# EAGLE design Raspberry_pi_shild_v1 (EAGLE 6.5.0)
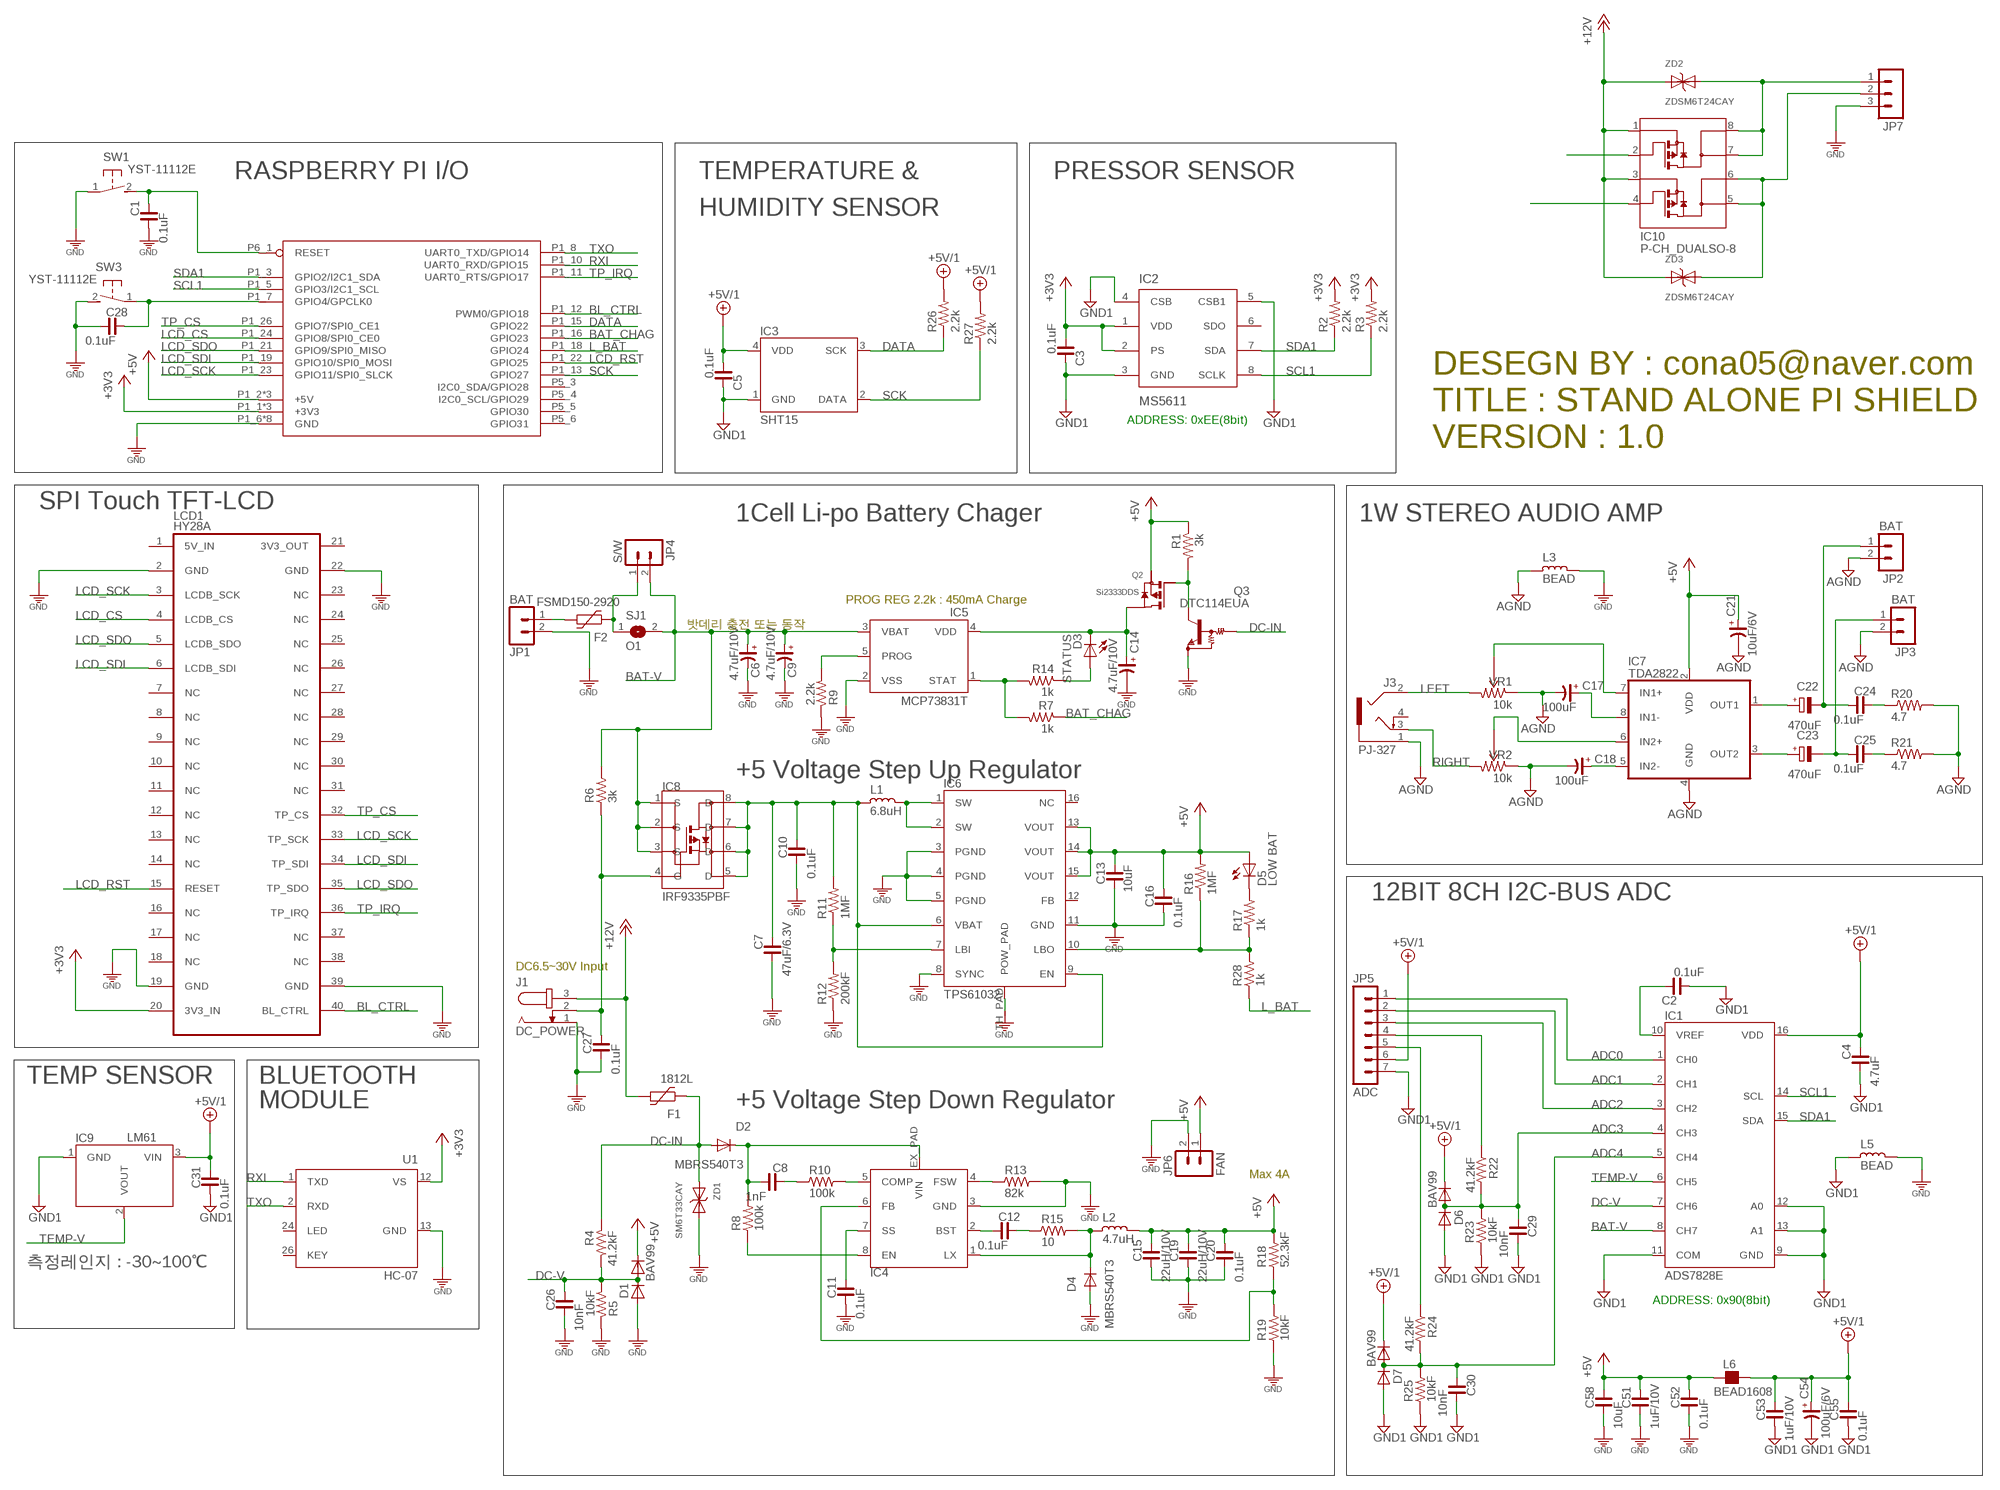
[diagram p0: schematic, sheet 1]

## Parts
C1  0.1uF  C_0603  [C0603]
C2  0.1uF  C_0603  [C0603]
C3  0.1uF  C_0603  [C0603]
C4  4.7uF  C_0805  [C0805]
C5  0.1uF  C_0603  [C0603]
C6  4.7uF/10V  CP_3216-18  [C3216-18/T]
C7  47uF/6.3V  C_3216  [C3216]
C8  1nF  C_0603  [C0603]
C9  4.7uF/10V  CP_3216-18  [C3216-18/T]
C10  0.1uF  C_0603  [C0603]
C11  0.1uF  C_0603  [C0603]
C12  0.1uF  C_0603  [C0603]
C13  10uF  C_2012  [C2012]
C14  4.7uF/10V  CP_3216-18  [C3216-18/T]
C15  22uH/10V  C_3216  [C3216]
C16  0.1uF  C_0603  [C0603]
C17  100uF  CP_3528-21  [C3528-21/T]
C18  100uF  CP_3528-21  [C3528-21/T]
C19  22uH/10V  C_3216  [C3216]
C20  0.1uF  C_0603  [C0603]
C21  10uF/6V  CP_3216-18  [C3216-18/T]
C22  470uF  CPOL-EUD/7343-31W  [D/7343-31W]
C23  470uF  CPOL-EUD/7343-31W  [D/7343-31W]
C24  0.1uF  C_0603  [C0603]
C25  0.1uF  C_0603  [C0603]
C26  10nF  C_0603  [C0603]
C27  0.1uF  C_0603  [C0603]
C28  0.1uF  C_0603  [C0603]
C29  10nF  C_0603  [C0603]
C30  10nF  C_0603  [C0603]
C31  0.1uF  C_0603  [C0603]
C51  1uF/10V  C_0603  [C0603]
C52  0.1uF  C_0603  [C0603]
C53  1uF/10V  C_0603  [C0603]
C54  100uF/6V  CP_3528-21  [C3528-21/T]
C55  0.1uF  C_0603  [C0603]
C58  10uF  C_0805  [C0805]
D1  BAV99  [SOT23]
D2  MBRS540T3  DIODE-SMC  [SMC]
D3  STATUS  LED3MM  [LED3MM]
D4  MBRS540T3  DIODE-SMC  [SMC]
D5  LOW BAT  LED3MM  [LED3MM]
D6  BAV99  [SOT23]
D7  BAV99  [SOT23]
F1  1812L  [1812L]
F2  FSMD150-2920  1812L  [1812L]
IC1  ADS7828E  ADS7828  [R-PDSO-G16]
IC2  MS5611  [LCP8]
IC3  SHT15  [SHT1X]
IC4  AOZ1284PI  [S08-EP1]
IC5  MCP73831T  [SOT23-5L@1]
IC6  TPS61032  [R-PDSO-G16-TH_PAD]
IC7  TDA2822  [SO08]
IC8  IRF9335PBF  HEXFET_P  [SO08]
IC9  LM61  [TO92-]
IC10  P-CH_DUALSO-8  [SO08-1]
J1  DC_POWER  JACK-PLUG0  [SPC4077]
J3  PJ-327  AUDIO_JACK2  [PJ-327-2]
JP1  BAT  MA02MOL-R  [MA02-MOL-R]
JP2  BAT  MA02MOL-R  [MA02-MOL-R]
JP3  BAT  MA02MOL-R  [MA02-MOL-R]
JP4  S/W  MA02MOL-R  [MA02-MOL-R]
JP5  ADC  MA07-1  [MA07-1T]
JP6  FAN  MA02MOL-R  [MA02-MOL-R]
JP7  MA03-1SMALL  [MA03-1-S]
L1  6.8uH  L_4545  [L4545]
L2  4.7uH  L_4545  [L4545]
L3  BEAD  L_0603  [L0603]
L5  BEAD  L_0603  [L0603]
L6  BEAD1608  FB_0603  [L0603]
LCD1  HY28A  [HY28A]
Q2  Si2333DDS  P-FET  [SOT23]
Q3  DTC114EUA  [SC59-BEC]
R1  3k  R_0603  [R0603]
R2  2.2k  R-US_R1608  [R0603]
R3  2.2k  R-US_R1608  [R0603]
R4  41.2kF  R_0603  [R0603]
R5  10kF  R_0603  [R0603]
R6  3k  R_0603  [R0603]
R7  1k  R_0603  [R0603]
R8  100k  R_0603  [R0603]
R9  2.2k  R_0603  [R0603]
R10  100k  R_0603  [R0603]
R11  1MF  R-US_R1608  [R0603]
R12  200kF  R-US_R1608  [R0603]
R13  82k  R_0603  [R0603]
R14  1k  R_0603  [R0603]
R15  10  R_0603  [R0603]
R16  1MF  R-US_R1608  [R0603]
R17  1k  R-US_R1608  [R0603]
R18  52.3kF  R_0603  [R0603]
R19  10kF  R_0603  [R0603]
R20  4.7  R-US_R1608  [R0603]
R21  4.7  R-US_R1608  [R0603]
R22  41.2kF  R_0603  [R0603]
R23  10kF  R_0603  [R0603]
R24  41.2kF  R_0603  [R0603]
R25  10kF  R_0603  [R0603]
R26  2.2k  R-US_R1608  [R0603]
R27  2.2k  R-US_R1608  [R0603]
R28  1k  R_0603  [R0603]
SJ1  O1  SJ  [SJ]
SW1  YST-11112E  [YST-1112E]
SW3  YST-11112E  [YST-1112E]
U1  HC-07  HC-06_MODULEFULL  [HC-06]
U$1  RPI-B-V2NO_SHIELD  [RPI-B-V2]
VR1  10k  R-TRIMMER-SMD3313  [R-TRIMMER-3313J]
VR2  10k  R-TRIMMER-SMD3313  [R-TRIMMER-3313J]
ZD1  SM6T33CAY  ZDSM6T33CAY  [SMB]
ZD2  ZDSM6T24CAY  ZDSM6T33CAY  [SMB]
ZD3  ZDSM6T24CAY  ZDSM6T33CAY  [SMB]

## Nets
+3V3: C3.2 IC2.1(VDD) IC2.2(PS) LCD1.20(3V3_IN) R2.2 R3.2 U1.12(VS) U$1.P1_1(+3V3) U$1.P1_17(+3V3) U$1.P5_2(+3V3)
+5V: C13.1 C15.1 C16.1 C19.1 C20.1 C21.+ C51.1 C52.1 C58.1 D1.S(C) D5.A IC6.13(VOUT) IC6.14(VOUT) IC6.15(VOUT) IC7.2(VDD) JP6.1 L2.1 L6.1 Q2.S(SOURCE) R1.1 R16.2 R18.2 U$1.P1_2(+5V) U$1.P1_4(+5V) U$1.P5_1(+5V)
+5V/1: C4.1 C5.2 C31.1 C53.1 C54.+ C55.1 D6.S(C) D7.S(C) IC1.16(VDD) IC3.4(VDD) IC9.3(VIN) JP5.6 L6.2 R26.2 R27.2
+12V: F1.P$2 IC10.1 IC10.3 J1.3 ZD2.A ZD3.A
ADC0: IC1.1(CH0) JP5.1
ADC1: IC1.2(CH1) JP5.2
ADC2: IC1.3(CH2) JP5.3
ADC3: C29.1 D6.D(AC) IC1.4(CH3) R22.2 R23.2
ADC4: C30.1 D7.D(AC) IC1.5(CH4) R24.2 R25.2
AGND: C17.- C18.- C21.- IC7.4(GND) J3.1 JP2.2 JP3.2 L3.2 R20.2 R21.2 VR1.1 VR2.1
BAT-V: C6.+ C9.+ IC1.8(CH7) IC5.3(VBAT) IC8.1(S) IC8.2(S) IC8.3(S) JP4.2 R6.2 SJ1.2
BAT_CHAG: R7.1 U$1.P1_16(GPIO23)
BL_CTRL: LCD1.40(BL_CTRL) U$1.P1_12(PWM0/GPIO18)
DATA: IC3.3(SCK) R26.1 U$1.P1_15(GPIO22)
DC-IN: D2.A F1.P$1 Q3.2(IN) R4.1 ZD1.A
DC-V: C26.1 D1.D(AC) IC1.7(CH6) R4.2 R5.2
GND [GND]: C1.2 C6.- C7.2 C9.- C10.2 C11.2 C13.2 C14.- C15.2 C16.2 C19.2 C20.2 C26.2 C27.2 C28.2 C51.2 C52.2 C58.2 D1.G(A) D4.A IC4.3(GND) IC5.2(VSS) IC6.3(PGND) IC6.4(PGND) IC6.5(PGND) IC6.8(SYNC) IC6.11(GND) IC6.TH_PAD(POW_PAD) J1.1 JP1.2 JP6.2 JP7.3 L3.1 L5.1 LCD1.2(GND) LCD1.19(GND) LCD1.22(GND) LCD1.39(GND) Q3.1(GND) R5.1 R9.1 R12.1 R13.2 R19.1 SW1.1 SW3.2 U1.13(GND) U$1.P1_6(GND) U$1.P1_9(GND) U$1.P1_14(GND) U$1.P1_20(GND) U$1.P1_25(GND) U$1.P5_7(GND) U$1.P5_8(GND) U$1.P6_2(GND) ZD1.C(K)
GND1: C2.2 C3.1 C4.2 C5.1 C29.2 C30.2 C31.2 C53.2 C54.- C55.2 D6.G(A) D7.G(A) IC1.9(GND) IC1.11(COM) IC1.12(A0) IC1.13(A1) IC2.3(GND) IC2.4(CSB) IC2.5(CSB1) IC3.1(GND) IC9.1(GND) JP5.7 L5.2 R23.1 R25.1
L_BAT: R28.1 U$1.P1_18(GPIO24)
LCD_CS: LCD1.4(LCDB_CS) U$1.P1_24(GPIO8/SPI0_CE0)
LCD_RST: LCD1.15(RESET) U$1.P1_22(GPIO25)
LCD_SCK: LCD1.3(LCDB_SCK) LCD1.33(TP_SCK) U$1.P1_23(GPIO11/SPI0_SLCK)
LCD_SDI: LCD1.6(LCDB_SDI) LCD1.34(TP_SDI) U$1.P1_19(GPIO10/SPI0_MOSI)
LCD_SDO: LCD1.5(LCDB_SDO) LCD1.35(TP_SDO) U$1.P1_21(GPIO9/SPI0_MISO)
LEFT: J3.2 VR1.3
N$1: C28.1 SW3.1 U$1.P1_7(GPIO4/GPCLK0)
N$2: C8.2 D2.C IC4.EX_PAD(VIN) R8.2
N$3: IC4.6(FB) R18.1 R19.2
N$4: C12.2 IC4.2(BST)
N$5: F2.P$1 JP4.1 SJ1.1
N$6: C27.1 IC8.4(G) J1.2 R6.1
N$7: D3.A R14.1
N$8: C12.1 R15.1
N$9: D4.C IC4.1(LX) L2.2 R15.2
N$10: IC4.5(COMP) R10.2
N$11: C8.1 R10.1
N$12: JP5.5 R24.1
N$13: C1.1 SW1.2 U$1.P6_1(RESET)
N$14: JP5.4 R22.1
N$15: D5.K(C) R17.2
N$16: F2.P$2 JP1.1
N$17: IC6.7(LBI) R11.1 R12.2
N$19: IC4.8(EN) R8.1
N$20: IC10.2
N$21: IC4.4(FSW) R13.1
N$22: C2.1 IC1.10(VREF)
N$23: Q2.G(GATE) Q3.3(OUT) R1.2
N$24: C11.1 IC4.7(SS)
N$26: C14.+ D3.K(C) IC5.4(VDD) Q2.D(DRAIN)
N$27: IC5.1(STAT) R7.2 R14.2
N$28: C7.1 C10.1 IC6.6(VBAT) IC6.9(EN) IC8.5(D) IC8.6(D) IC8.7(D) IC8.8(D) L1.2 R11.2
N$29: IC6.10(LBO) R16.1 R17.1 R28.2
N$30: IC6.1(SW) IC6.2(SW) L1.1
N$31: IC10.4
N$35: IC5.5(PROG) R9.2
N$36: C17.+ IC7.8(IN1-)
N$37: C18.+ IC7.5(IN2-)
N$39: IC7.6(IN2+) VR2.2
N$41: IC7.7(IN1+) VR1.2
N$42: C22.+ IC7.1(OUT1)
N$43: C23.+ IC7.3(OUT2)
N$44: C22.- C24.2 JP2.1
N$45: C23.- C25.2 JP3.1
N$46: C24.1 R20.1
N$47: C25.1 R21.1
RELAY1: IC10.5 IC10.6 JP7.2 ZD3.C(K)
RELAY2: IC10.7 IC10.8 JP7.1 ZD2.C(K)
RIGHT: J3.3 VR2.3
RXI: U1.1(TXD) U$1.P1_10(UART0_RXD/GPIO15)
SCK: IC3.2(DATA) R27.1 U$1.P1_13(GPIO27)
SCL1: IC1.14(SCL) IC2.8(SCLK) R3.1 U$1.P1_5(GPIO3/I2C1_SCL)
SDA1: IC1.15(SDA) IC2.7(SDA) R2.1 U$1.P1_3(GPIO2/I2C1_SDA)
TEMP-V: IC1.6(CH5) IC9.2(VOUT)
TP_CS: LCD1.32(TP_CS) U$1.P1_26(GPIO7/SPI0_CE1)
TP_IRQ: LCD1.36(TP_IRQ) U$1.P1_11(UART0_RTS/GPIO17)
TXO: U1.2(RXD) U$1.P1_8(UART0_TXD/GPIO14)
Unconnected: IC2.6(SDO) IC6.12(FB) IC6.16(NC) J3.4 LCD1.1(5V_IN) LCD1.7(NC) LCD1.8(NC) LCD1.9(NC) LCD1.10(NC) LCD1.11(NC) LCD1.12(NC) LCD1.13(NC) LCD1.14(NC) LCD1.16(NC) LCD1.17(NC) LCD1.18(NC) LCD1.21(3V3_OUT) LCD1.23(NC) LCD1.24(NC) LCD1.25(NC) LCD1.26(NC) LCD1.27(NC) LCD1.28(NC) LCD1.29(NC) LCD1.30(NC) LCD1.31(NC) LCD1.37(NC) LCD1.38(NC) U1.24(LED) U1.26(KEY)

## Notes on the sheet
- RASPBERRY PI I/O | TEMPERATURE & | PRESSOR SENSOR
- HUMIDITY SENSOR
- DESEGN BY : cona05@naver.com
- TITLE : STAND ALONE PI SHIELD
- ADDRESS: 0xEE(8bit)
- VERSION : 1.0
- SPI Touch TFT-LCD
- 1Cell Li-po Battery Chager | 1W STEREO AUDIO AMP
- PROG REG 2.2k : 450mA Charge
- 밧데리 충전 또는 동작
- +5 Voltage Step Up Regulator
- 12BIT 8CH I2C-BUS ADC
- DC6.5~30V Input
- TEMP SENSOR | BLUETOOTH
- MODULE | +5 Voltage Step Down Regulator
- Max 4A
- 측정레인지 : -30~100℃
- ADDRESS: 0x90(8bit)

## Power pins joined to a net without a drawn wire
GPIO30: U$1.P5_5(GPIO30)
GPIO31: U$1.P5_6(GPIO31)
I2C0_SCL/GPIO29: U$1.P5_4(I2C0_SCL/GPIO29)
I2C0_SDA/GPIO28: U$1.P5_3(I2C0_SDA/GPIO28)

## Library data of the parts
C1-C5 C7 C8 C10-C13 C15 C16 C19 C20 C24-C31 C51-C53 C55 C58 = cona_lib:C_: NON-POLARIZED CAP
C6 C9 C14 C17 C18 C21 C54 = rc-master-smd:CP_: POLARIZED CAP
C22 C23 = cona_lib:CPOL-EU: POLARIZED CAPACITOR, European symbol
D1 D6 D7 = cona_lib:BAV99
D2 D4 = diode:DIODE-: DIODE
D3 D5 = cona_lib:LED: LED OSRAM: - CHIPLED LG R971, LG N971, LY N971, LG Q971, LY Q971, LO R971, LY R971 LH N974, LH R974 LS Q976, LO Q976, LY Q976 LO Q996 - Hyper CHIPLED LW Q18S LB Q993, LB Q99A, LB R99A - SideLED LS A670, LO A670, LY A670, LG A670, LP A670 LB A673, LV A673, LT A673, LW A673 LH A674 LY A675 LS A676, LA A676, LO A676, LY A676, LW A676 LS A679, LY A679, LG A679 - Hyper Micro SIDELED® LS Y876, LA Y876, LO Y876, LY Y876 LT Y87S - SmartLED LW L88C, LW L88S LB L89C, LB L89S, LG L890 LS L89K, LO L89K, LY L89K LS L896, LA L896, LO L896, LY L896 - TOPLED LS T670, LO T670, LY T670, LG T670, LP T670 LSG T670, LSP T670, LSY T670, LOP T670, LYG T670 LG T671, LOG T671, LSG T671 LB T673, LV T673, LT T673, LW T673 LH T674 LS T676, LA T676, LO T676, LY T676, LB T676, LH T676, LSB T676, LW T676 LB T67C, LV T67C, LT T67C, LS T67K, LO T67K, LY T67K, LW E67C LS E67B, LA E67B, LO E67B, LY E67B, LB E67C, LV E67C, LT E67C LW T67C LS T679, LY T679, LG T679 LS T770, LO T770, LY T770, LG T770, LP T770 LB T773, LV T773, LT T773, LW T773 LH T774 LS E675, LA E675, LY E675, LS T675 LS T776, LA T776, LO T776, LY T776, LB T776 LHGB T686 LT T68C, LB T68C - Hyper Mini TOPLED® LB M676 - Mini TOPLED Santana® LG M470 LS M47K, LO M47K, LY M47K Source: http://www.osram.convergy.de LUXEON: - LUMILED® LXK2-PW12-R00, LXK2-PW12-S00, LXK2-PW14-U00, LXK2-PW14-V00 LXK2-PM12-R00, LXK2-PM12-S00, LXK2-PM14-U00 LXK2-PE12-Q00, LXK2-PE12-R00, LXK2-PE12-S00, LXK2-PE14-T00, LXK2-PE14-U00 LXK2-PB12-K00, LXK2-PB12-L00, LXK2-PB12-M00, LXK2-PB14-N00, LXK2-PB14-P00, LXK2-PB14-Q00 LXK2-PR12-L00, LXK2-PR12-M00, LXK2-PR14-Q00, LXK2-PR14-R00 LXK2-PD12-Q00, LXK2-PD12-R00, LXK2-PD12-S00 LXK2-PH12-R00, LXK2-PH12-S00 LXK2-PL12-P00, LXK2-PL12-Q00, LXK2-PL12-R00 Source: www.luxeon.com KINGBRIGHT: KA-3528ASYC Source: www.kingbright.com
F1 F2 = ptc-littlefuse:1812L
IC1 = cona_lib:ADS7828
IC2 = MEASUREMENT_SENSOR:MS5611
IC3 = cona_lib:SHT15
IC4 = cona_lib:AOZ1284PI
IC5 = cona_lib:MCP73831T
IC6 = cona_lib:TPS61032
IC7 = cona_lib:TDA2822
IC8 = cona_lib:HEXFET_P
IC9 = cona_lib:LM61
IC10 = cona_lib:P-CH_DUAL
J1 = con-jack:JACK-PLUG: DC POWER JACK Power Jack, DC, Right Angle, Through Hole, Rated 5A at 16VDC, PC Terminals Distributor: Farnell (www.Farnell.de) Drawing: 84N1161.pdf / 84N1162.pdf Manufacturer: SPC Technology (www.spctechnology.com) Type: SPC4077 / SPC 4078
J3 = cona_lib:AUDIO_JACK2
JP1-JP4 JP6 = cona_lib:MA02
JP5 = cona_lib:MA07-1
JP7 = cona_lib:MA03-1: PIN HEADER
L1-L3 L5 = cona_lib:L_: INDUCTOR
L6 = rc-master-smd:FB_: FERRITE BEAD
LCD1 = TFT-LCD:HY28A
Q2 = cona_lib:P-FET
Q3 = cona_lib:DTC114EUA: NPN Bias Resistor Transistor
R1 R4-R10 R13-R15 R18 R19 R22-R25 R28 = cona_lib:R_: RESISTOR
R2 R3 R11 R12 R16 R17 R20 R21 R26 R27 = cona_lib:R-US_: RESISTOR, American symbol
SJ1 = cona_lib:SJ: SMD solder JUMPER
SW1 SW3 = switch-tact:YST-11112E
U1 = cona_lib:HC-06_MODULE
U$1 = raspberrypi:RPI-B-V2: Second revision of the Model 2 board including the P5 and P6 headers. Mounting holes have been added. Choose the "SHIELD" variant for a predefined Dimension layer and drilling holes. Theres also a "SHIELD" variant for the Model A without a RJ45 connector.
VR1 VR2 = cona_lib:R-TRIMMER-SMD: SMD R-TRIMMER
ZD1-ZD3 = GRU-EURO6:ZD

## Net classes
0 default: width 0.178 mm, drill 0.3 mm, clearance 0.178 mm
1 power: width 0.152 mm
2 GND: width 0.152 mm, clearance 0.152 mm

## Board
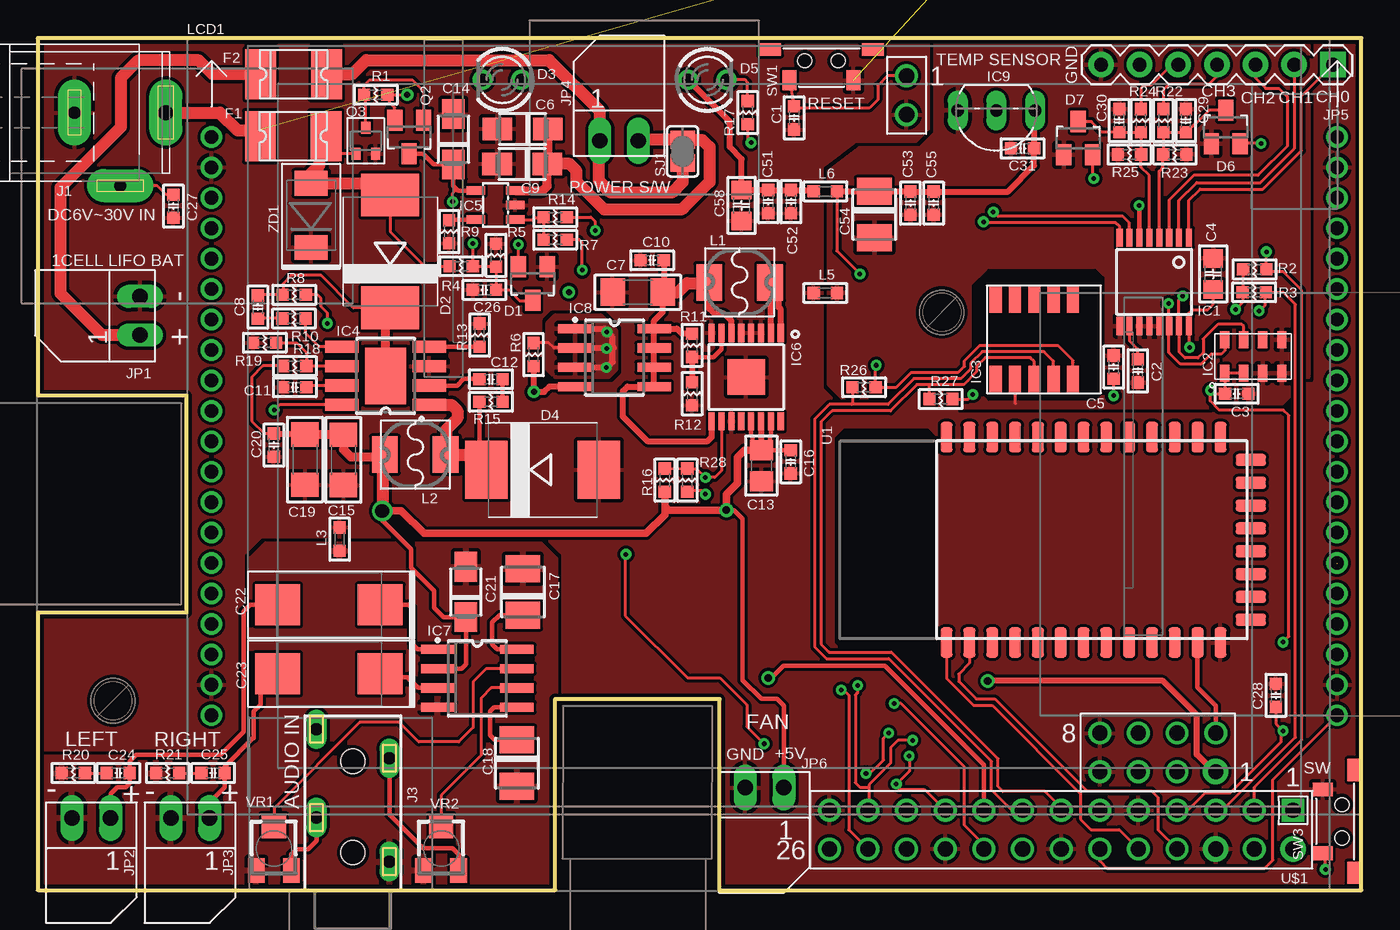
[diagram p1: board, top side]
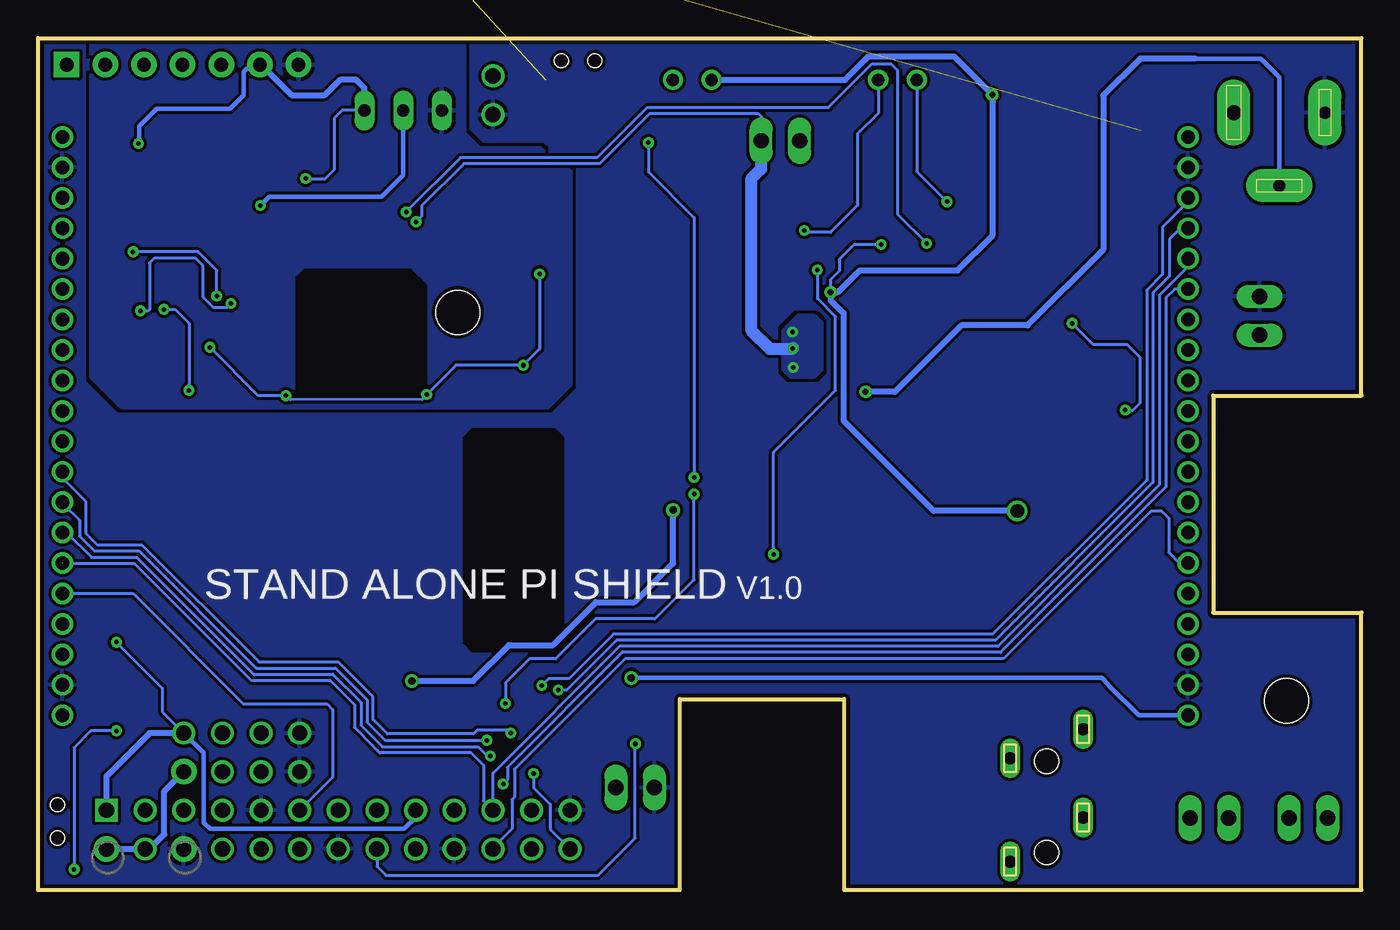
[diagram p2: board, bottom side, seen from below]

Size 87 x 56 mm. Coordinates in mm from the lower left corner, seen from the top.
Outline: 87,56 0,56 0,32.5 9.75,32.5 9.75,18.25 0,18.25 0,0 34,0 34,12.55 44.8,12.55 44.8,0 87,0 87,56
Copper layers (1*16): Top 0.035mm / dielectric 1.5mm / Bottom 0.035mm
Design rules "KHC_mm": minimum track width 0.2mm, minimum drill 0.3mm, track to track 0.2mm, track to pad 0.2mm, pad to pad 0.2mm, via to via 0.2mm, smd to smd 0.2mm, copper to edge 10mil, drill to drill 0.2mm, minimum pad ring 10mil, minimum via ring 8mil, stop-mask expansion 4mil, vias tented up to drill 0mil, thermal gap 10mil
Holes 2.9 mm at 59.4,37.98 4.92,12.45

### Footprints (pad centres in the part's own frame; a part is rotated, then mirrored left to right if it is on the bottom)
C0603 = smd 0.8 x 0.8: 1 -0.762,0; 2 0.762,0
C0805 = smd 1.2 x 1.3: 1 -1.016,0; 2 1.016,0
C3216-18/T = smd 1.95 x 1.5: + 1.651,0; - -1.651,0
C3216 = smd 1.6 x 1.8: 1 -1.651,0; 2 1.651,0
C2012 = smd 1.3 x 1.5: 1 -1.016,0; 2 1.016,0
C3528-21/T = smd 1.778 x 2.286: + 1.524,0; - -1.524,0
D/7343-31W = smd 2.95 x 2.7: + 3.375,0; - -3.375,0
SOT23 = smd 1 x 1.4: D 0,-1.1; G 0.95,1.1; S -0.95,1.1
SMC = smd 2.8 x 3.8: A 3.7,0; C -3.7,0
LED3MM = drill 0.813: A -1.27,0; K 1.27,0
1812L = smd 2.03 x 3.3: P$1 -2.16,0; P$2 2.16,0
R-PDSO-G16 = smd 0.4 x 1.2: 1 -2.275,-2.9; 2 -1.625,-2.9; 3 -0.975,-2.9; 4 -0.325,-2.9; 5 0.325,-2.9; 6 0.975,-2.9; 7 1.625,-2.9; 8 2.275,-2.9; 9 2.275,2.9; 10 1.625,2.9; 11 0.975,2.9; 12 0.325,2.9; 13 -0.325,2.9; 14 -0.975,2.9; 15 -1.625,2.9; 16 -2.275,2.9
LCP8 = smd 1.1 x 0.6: 1 -1.1,1.875; 2 -1.1,0.625; 3 -1.1,-0.625; 4 -1.1,-1.875; 5 1.1,-1.875; 6 1.1,-0.625; 7 1.1,0.625; 8 1.1,1.875
SHT1X = smd 1.8 x 0.8: 1 -2.64,1.905; 2 -2.64,0.635; 3 -2.64,-0.635; 4 -2.64,-1.905; NC 2.64,-1.905; NC@1 2.64,-0.635; NC@2 2.64,0.635; NC@3 2.64,1.905; NC@4 2.64,3.175; NC@5 -2.64,3.175
S08-EP1 = smd 0.8 x 2.2: 1 -1.905,-2.87; 2 -0.635,-2.87; 3 0.635,-2.87; 4 1.905,-2.87; 5 1.905,2.87; 6 0.635,2.87; 7 -0.635,2.87; 8 -1.905,2.87 | smd 3.7 x 2.71: EX_PAD 0,0
SOT23-5L@1 = smd 0.55 x 1.2: 1 -0.95,-1.3; 2 0,-1.3; 3 0.95,-1.3; 4 0.95,1.3; 5 -0.95,1.3
R-PDSO-G16-TH_PAD = smd 0.4 x 1.2: 1 -2.275,-2.9; 2 -1.625,-2.9; 3 -0.975,-2.9; 4 -0.325,-2.9; 5 0.325,-2.9; 6 0.975,-2.9; 7 1.625,-2.9; 8 2.275,-2.9; 9 2.275,2.9; 10 1.625,2.9; 11 0.975,2.9; 12 0.325,2.9; 13 -0.325,2.9; 14 -0.975,2.9; 15 -1.625,2.9; 16 -2.275,2.9 | smd 2.46 x 2.31: TH_PAD 0,0
SO08 = smd 0.6 x 2.2: 1 -1.905,-2.6; 2 -0.635,-2.6; 3 0.635,-2.6; 4 1.905,-2.6; 5 1.905,2.6; 6 0.635,2.6; 7 -0.635,2.6; 8 -1.905,2.6
TO92- = drill 0.813 long: 1 2.54,0; 2 0,0; 3 -2.54,0
SO08-1 = smd 0.6 x 2.2: 1 -1.905,-2.6; 2 -0.635,-2.6; 3 0.635,-2.6; 4 1.905,-2.6; 5 1.905,2.6; 6 0.635,2.6; 7 -0.635,2.6; 8 -1.905,2.6
SPC4077 = drill 0.8 pad 2.184 long: 1 -3,0; 2 0,-4.8 | drill 1 pad 2.184 long: 3 3,0
PJ-327-2 = drill 0.8 long: 1 -2.4,-1.9; 2 2.4,-4.8; 3 -2.4,-8.7; 4 2.4,-10.6 | hole 1.6: 0,-2.5; 0,-8.5
MA02-MOL-R = drill 1.016 long: 1 -1.27,0; 2 1.27,0
MA07-1T = drill 0.9 pad 1.676 square: 1 -7.62,0 | drill 0.9 pad 1.676: 2 -5.08,0; 3 -2.54,0; 4 0,0; 5 2.54,0; 6 5.08,0; 7 7.62,0
MA03-1-S = drill 0.9 pad 1.676 square: 1 -2.54,0 | drill 0.9 pad 1.676: 2 0,0; 3 2.54,0
L4545 = smd 1.7 x 2.4: 1 -2,0; 2 2,0
L0603 = smd 0.8 x 0.8: 1 -0.762,0; 2 0.762,0
HY28A = drill 0.9: 1 -37,19; 2 -37,17; 3 -37,15; 4 -37,13; 5 -37,11; 6 -37,9; 7 -37,7; 8 -37,5; 9 -37,3; 10 -37,1; 11 -37,-1; 12 -37,-3; 13 -37,-5; 14 -37,-7; 15 -37,-9; 16 -37,-11; 17 -37,-13; 18 -37,-15; 19 -37,-17; 20 -37,-19; 21 37,19; 22 37,17; 23 37,15; 24 37,13; 25 37,11; 26 37,9; 27 37,7; 28 37,5; 29 37,3; 30 37,1; 31 37,-1; 32 37,-3; 33 37,-5; 34 37,-7; 35 37,-9; 36 37,-11; 37 37,-13; 38 37,-15; 39 37,-17; 40 37,-19
SC59-BEC = smd 0.6 x 0.8: 1 0.65,-0.863; 2 -0.65,-0.863; 3 0,0.863
R0603 = smd 0.8 x 0.8: 1 -0.762,0; 2 0.762,0
SJ = smd 1.168 x 1.6: 1 -0.762,0; 2 0.762,0
YST-1112E = smd 0.9 x 1.3: 1 -2.1,1.025; 2 2.1,1.025 | smd 1.45 x 0.8: SH -3.375,-1; SH@1 3.375,-1 | hole 0.9: 1.1,-0.25; -1.1,-0.25
HC-06 = smd 2 x 0.8: 1 -6.75,9; 2 -6.75,7.5; 3 -6.75,6; 4 -6.75,4.5; 5 -6.75,3; 6 -6.75,1.5; 7 -6.75,0; 8 -6.75,-1.5; 9 -6.75,-3; 10 -6.75,-4.5; 11 -6.75,-6; 12 -6.75,-7.5; 13 -6.75,-9; 22 6.75,-9; 23 6.75,-7.5; 24 6.75,-6; 25 6.75,-4.5; 26 6.75,-3; 27 6.75,-1.5; 28 6.75,0; 29 6.75,1.5; 30 6.75,3; 31 6.75,4.5; 32 6.75,6; 33 6.75,7.5; 34 6.75,9 | smd 0.8 x 2: 14 -5.25,-11; 15 -3.75,-11; 16 -2.25,-11; 17 -0.75,-11; 18 0.75,-11; 19 2.25,-11; 20 3.75,-11; 21 5.25,-11
RPI-B-V2 = drill 1 square: P1_1 0,0 | drill 1 pad 1.676: P1_2 0,2.54; P1_6 5.08,2.54; P5_1 5.08,-2.54 | drill 1: P1_3 2.54,0; P1_4 2.54,2.54; P1_5 5.08,0; P1_7 7.62,0; P1_8 7.62,2.54; P1_9 10.16,0; P1_10 10.16,2.54; P1_11 12.7,0; P1_12 12.7,2.54; P1_13 15.24,0; P1_14 15.24,2.54; P1_15 17.78,0; P1_16 17.78,2.54; P1_17 20.32,0; P1_18 20.32,2.54; P1_19 22.86,0; P1_20 22.86,2.54; P1_21 25.4,0; P1_22 25.4,2.54; P1_23 27.94,0; P1_24 27.94,2.54; P1_25 30.48,0; P1_26 30.48,2.54; P5_2 5.08,-5.08; P5_3 7.62,-2.54; P5_4 7.62,-5.08; P5_5 10.16,-2.54; P5_6 10.16,-5.08; P5_7 12.7,-2.54; P5_8 12.7,-5.08; P6_1 25.4,-48.26; P6_2 25.4,-45.72
R-TRIMMER-3313J = smd 1.1 x 1.6: 1 -1.15,-1.45; 3 1.15,-1.45 | smd 1.6 x 1.6: 2 0,1.45
SMB = smd 1.62 x 2.18: A 2.11,0; C -2.11,0

### Placement (x,y rotation side)
C1  49.7,50.75 270 top
C2  72.3,34.12 270 top
C3  78.8,32.62 180 top
C4  77.25,40.5 90 top
C5  70.7,34.38 270 top
C6  31.85,50.02 0 top
C7  39.42,39.3 180 top
C8  14.45,38.33 90 top
C9  31.82,47.73 0 top
C10  40.38,41.4 180 top
C11  16.88,33.05 180 top
C12  29.77,33.58 180 top
C13  47.55,27.9 270 top
C14  27.3,49.35 270 top
C15  20.07,28.27 270 top
C16  49.48,28.15 270 top
C17  31.88,19.6 270 top
C18  31.48,8.35 90 top
C19  17.55,28.3 270 top
C20  15.5,29.25 270 top
C21  28.12,19.6 270 top
C22  19.12,18.75 0 top
C23  19.12,14.23 0 top
C24  5.27,7.7 0 top
C25  11.5,7.7 0 top
C26  29.35,39.45 180 top
C27  8.9,44.95 270 top
C28  81.38,12.8 90 top
C29  75.45,50.58 90 top
C30  71.08,50.58 90 top
C31  64.72,48.75 180 top
C51  48,45.25 270 top
C52  49.5,45.25 270 top
C53  57.35,45.15 270 top
C54  54.98,44.4 90 top
C55  58.88,45.15 270 top
C58  46.25,45 270 top
D1  32.52,39.88 0 top
D2  23.15,41.98 90 top
D3  30.5,53.25 180 top
D4  33.17,27.62 0 top
D5  44,53.25 0 top
D6  78.08,50.15 180 top
D7  68.38,49.42 180 top
F1  16.77,49.55 180 top
F2  16.8,53.62 180 top
IC1  73.38,39.98 180 top
IC2  79.88,35.08 90 top
IC3  66.12,36.2 90 top
IC4  22.85,33.8 90 top
IC5  30.07,45.02 90 top
IC6  46.55,33.73 180 top
IC7  28.88,13.92 270 top
IC8  37.9,35 270 top
IC9  63,51.25 180 top
IC10  73,64 270 top  (outside the outline)
J1  5.4,51.1 0 top
J3  20.7,-0.02 180 top
JP1  6.7,37.75 90 top
JP2  3.5,4.75 180 top
JP3  10,4.75 180 top
JP4  38.2,49.25 0 top
JP5  77.5,54.25 180 top
JP6  47.75,6.75 180 top
JP7  68,71.75 0 top  (outside the outline)
L1  46.12,39.95 180 top
L2  24.8,28.62 0 top
L3  19.82,23.08 270 top
L5  51.75,39.25 0 top
L6  51.75,45.92 0 top
LCD1  48.4,30.5 0 top
Q2  24.4,49.5 0 top
Q3  21.55,49.25 0 top
R1  22.2,52.27 180 top
R2  79.97,40.8 180 top
R3  79.95,39.3 180 top
R4  27.82,41 0 top
R5  30.1,41.73 270 top
R6  32.58,35.2 90 top
R7  34,42.75 180 top
R8  16.85,39.12 180 top
R9  27.02,43.27 90 top
R10  16.82,37.58 0 top
R11  43,35.8 90 top
R12  43,32.62 90 top
R13  29.02,36.48 90 top
R14  34,44.23 180 top
R15  29.77,32.1 180 top
R16  41.2,26.95 270 top
R17  46.65,51.1 90 top
R18  16.88,34.45 180 top
R19  14.9,35.98 0 top
R20  2.33,7.7 180 top
R21  8.52,7.7 180 top
R22  73.97,50.58 270 top
R23  74.72,48.35 180 top
R24  72.5,50.58 270 top
R25  71.75,48.35 0 top
R26  54.3,33.05 0 top
R27  59.35,32.27 0 top
R28  42.67,26.95 90 top
SJ1  42.38,48.55 90 top
SW1  51.5,54.25 180 top
SW3  85.47,4.52 90 top
U1  68.72,23.02 90 top
U$1  82.5,5.25 180 top
VR1  15.5,2.75 0 top
VR2  26.5,2.75 0 top
ZD1  17.95,44.35 90 top
ZD2  65.75,64.75 270 top  (outside the outline)
ZD3  58.75,64.75 270 top  (outside the outline)

### Tracks (layer width: path | path; a pad name or v marks a point on that pad's centre or on a via)
+3V3  (via drill 0.3, 0.5)
  Top 0.2: IC2.2 IC2.1 78,32.66 C3.2 | 78.03,32.61 C3.2 | R2.2 79.21,39.33 R3.2 79.19,38.64 v78.72,38.17 | C3.2 77.28,32.62 77.08,32.83 v77.08,32.85 77.05,32.83 77.05,32.15 77.65,31.55 81.88,31.55 82.22,31.2 82.22,16.67 v81.85,16.3
  Top 0.3: U$1.P1_17 62.17,8.25 55.67,14.75 49,14.75 48.23,13.98 v48,13.95 | U1.12 76.22,13.33 77.42,12.12 U$1.P5_2
  Bottom 0.2: v78.72,38.17 78,38.17 77.08,37.25 v77.08,32.85 | v81.85,16.3 78.83,13.27 78.83,11.73 U$1.P5_2
  Bottom 0.3: LCD1.20 14.65,11.5 16.62,13.48 16.62,13.5 17.07,13.95 v48,13.95 | U$1.P1_17 62.18,4.77 62.92,4.02 75.7,4.02 76.12,4.45 76.12,9.03 U$1.P5_2
  Bottom 0.4: U$1.P1_1 82.5,7.5 79.67,10.33 U$1.P5_2
+5V  (via drill 0.3, 0.4, 0.5, 0.9)
  Top 0.2: R18.2 14.77,34.45 14.05,33.73 14.05,30.82 14.85,30.02 15.49,30.02 C20.1 | v24.27,52.27 R1.1 23.12,52.11 23.12,51.75 23.45,51.42 Q2.S | D1.S v31.57,42.42
  Top 0.3: IC7.2 27.84,14.56 28.12,14.85 C21.+ 28.1,17.92 26.68,17.92 26.02,18.58 26.02,19.67 24.52,21.17 24.52,22.4 22.62,24.3 v22.62,24.93 | C16.1 C13.1 | IC6.15 48.17,29.9 48.1,29.82 48.1,29.47 C13.1 | IC6.13 46.88,29.85 46.98,29.75 46.98,29.49 C13.1 | JP6.1 49.02,12.13 48.58,12.58 47.55,12.58 46.33,13.8 46.33,24.4 45.75,24.98 v45.25,24.98
  Top 0.4: IC6.14 47.52,28.94 C13.1 | D5.A 45.48,50.51 45.48,48.83 46.25,48.05 C58.1 C51.1 C52.1 50.9,46.01 L6.1 | U$1.P5_1 77.31,7.79 76.17,8.92 76.17,11.52 73.95,13.75 v62.42,13.75
  Top 0.406: C19.1 15.56,29.95 C20.1
  Top 0.5: 22.65,24.95 23.88,24.95 25.38,23.45 39.98,23.45 41.2,24.67 41.2,25.23 | C13.1 46.45,28.93 45.98,28.45 45.98,26.75 45.25,26.02 v45.25,24.98 41.45,24.98 41.2,25.23 | 41.2,25.23 R16.2
  Top 0.6: C19.1 17.57,29.93 C15.1 20.07,28.95 20.55,28.48 22.65,28.48 L2.1
  Top 0.8: 22.65,28.48 22.65,24.95 v22.62,24.93
  Bottom 0.2: v31.57,42.42 33.35,42.42 34.33,41.45 34.33,40.7 34.9,40.12 v34.9,39.3
  Bottom 0.4: U$1.P1_2 U$1.P1_4 79.66,2.71 78.7,3.67 78.7,6.51 U$1.P5_1 | D5.A 33.95,53.25 32.4,54.8 26.8,54.8 v24.27,52.27 24.27,43 26.55,40.73 32.98,40.73 34.4,39.3 v34.9,39.3 34.9,38.77 34.05,37.92 34.05,30.85 28.12,24.93 v22.62,24.93 | v62.42,13.75 58.4,13.75 56.05,16.1 53.15,16.1 50.33,18.92 47.8,18.92 45.25,21.48 v45.25,24.98
+5V/1  (via drill 0.3)
  Top 0.2: v80.4,49.08 79.05,49.08 D6.S | D7.S 69.33,46.85 v69.4,46.77 | 77.43,39.3 C4.1 77.25,38.5 76.9,38.15 75.88,38.15 75.65,37.92 IC1.16 75.65,35.73 v75.7,35.67 | v55.1,34.5 55.06,34.46 R26.2 56.42,33.05 57.4,34.02 60.5,34.02 60.9,34.42 60.9,34.8 61.9,35.8 67.06,35.8 68.03,34.83 IC3.4 68.03,34.68 | 60.16,32.23 R27.2 61.15,32.27 v61.45,32.58 | L6.2 52.51,42.01 v54.02,40.5 | C5.2 70.69,33.35 70.69,32.49 v70.7,32.5
  Top 0.4: L6.2 C54.+ 57.34,45.92 C53.1 C55.1 63.76,45.91 65.47,47.62 65.47,48.74 C31.1 65.49,51.2 IC9.3
  Bottom 0.2: 80.38,49.05 v80.4,49.08 80.35,49.02 | IC9.3 67,51.25 67.53,50.73 67.53,47.35 68.15,46.73 69.35,46.73 v69.4,46.77 | 55.02,34.58 v55.1,34.5 | v54.02,40.5 54.02,35.58 v55.1,34.5 | v55.1,34.5 59.52,34.5 v61.45,32.58 61.45,32.55 61.75,32.25 70.42,32.23 v70.7,32.5 72.53,32.5 v75.7,35.67
  Bottom 0.3: v80.4,49.08 80.35,49.12 80.35,50.2 79.2,51.35 74.38,51.35 73.47,52.25 73.47,53.77 73,54.25 72.67,54.25
  Bottom 0.4: IC9.3 65.54,52.72 66.08,53.25 67.15,53.25 68.15,52.25 70.33,52.25 72.33,54.25 JP5.6 72.67,54.25
+12V  (4 unrouted)
  Top 0.8: J1.3 11.95,51.1 13.12,49.92 14.52,49.92 F1.P$2
ADC0
  Top 0.2: IC1.1 75.65,45.33 76.4,46.08 80.53,46.08 83.05,48.6 83.05,52.18 JP5.1
ADC1
  Top 0.2: IC1.2 75,45.33 76.17,46.5 80.35,46.5 82.58,48.73 JP5.2
ADC2
  Top 0.2: IC1.3 74.35,45.35 75.97,46.98 80.2,46.98 82.12,48.9 82.12,52.15 81.58,52.7 80.7,52.7 80.04,53.36 JP5.3
ADC3
  Top 0.2: D6.D 78.05,51.27 77.03,51.27 76.24,50.49 C29.1 R22.2 R23.2 73.95,48.34 73.95,47.5 73.7,47.25 IC1.4
ADC4
  Top 0.2: D7.D 68.4,50.5 69.25,50.5 69.94,49.81 C30.1 R24.2 72.5,48.36 R25.2 72.5,48.34 72.5,47.52 73.05,46.98 IC1.5
AGND
  pour Top: 0,-0.25 0,8.75 12,8.75 14,10.75 14,21.75 15,22.75 33,22.75 34,21.75 34,-1.25
BAT-V  (via drill 0.3)
  Top 0.2: IC8.2 33.91,35.64 33.58,35.98 32.59,35.98 R6.2 | IC1.8 71.1,43.62 70.85,43.88 62.2,43.88 v62.15,43.92
  Top 0.4: IC8.2 37.84,35.64 | 37.84,35.64 37.85,35.65 37.73,35.77 37.73,36.4 37.22,36.91 IC8.1 | IC8.3 37.41,34.36 37.77,34.73 37.77,35.58 37.84,35.64
  Top 0.6: C6.+ 33.5,47.75 C9.+ 33.48,46.27 33.17,45.98 IC5.3
  Top 0.8: C9.+ 34.95,47.73 35.4,47.27 35.4,46.55 37.23,44.73 42.27,44.73 42.35,44.8 42.4,44.8 44.15,46.55 44.15,48.83 43.66,49.31 SJ1.2 39.53,49.31 JP4.2
  Bottom 0.2: JP4.2 39.48,50.85 39.67,51.05 46.77,51.05 50.08,47.75 59,47.75 61.77,44.98 61.77,44.3 v62.15,43.92
  Bottom 0.8: JP4.2 39.47,47.41 40.12,46.75 40.12,36.8 38.9,35.58 37.41,35.58 37.35,35.64
  other vias: 37.4,36.67 37.38,35.6 37.35,34.35
  pour Top: 34,37.75 37,37.75 38,36.75 38,34.25 37.5,33.75 34,33.75 33.5,34.25 33.5,37.25
  pour Bottom: 36,37.75 37,37.75 38,36.75 38,34.25 37.5,33.75 36,33.75 35.5,34.25 35.5,37.25
BAT_CHAG  (via drill 0.3)
  Top 0.2: v38.65,22.08 38.6,22.02 38.6,18.05 42.7,13.95 44.83,13.95 46.6,12.17 46.6,10.75 v47.73,9.62 | v35.77,40.75 35.77,42.55 35.58,42.75 R7.1
  Bottom 0.2: U$1.P1_16 64.72,1.57 64.12,0.98 50.2,0.98 47.75,3.42 47.75,9.6 v47.73,9.62 | v38.65,22.08 38.65,28.77 34.58,32.85 34.58,37.7 35.77,38.9 v35.77,40.75
BL_CTRL
  Top 0.2: U$1.P1_12 69.8,1.92 70.28,1.45 80.65,1.45 81.17,1.98 81.17,7.27 LCD1.40
DATA
  Top 0.2: U$1.P1_15 64.03,5.25 62.67,6.6 62.67,8.48 55.92,15.23 51.83,15.23 51.05,16 51.05,30.95 52.02,31.93 53.5,31.93 | IC3.3 66.76,34.77 66.12,35.4 62.08,35.4 61.3,34.62 61.3,34.25 60.67,33.62 57.58,33.62 55.88,31.93 53.5,31.93 | R26.1 53.54,31.96 53.5,31.93
DC-IN
  Top 0.2: Q3.2 18.86,48.39 18.5,48.75 | D2.A 23.15,43.27 25.43,41 R4.1
  Top 0.8: F1.P$1 18.5,49.12 18.5,48.75 18.5,47.65 17.95,47.1 ZD1.A 22.36,46.46 D2.A
DC-V  (via drill 0.3)
  Top 0.2: D1.D 32.5,38.75 31.65,38.75 30.95,39.45 C26.1 30.1,39.46 R5.2 30.06,41 R4.2 28.57,41.01 v28.57,42.5 | IC1.7 71.75,43.85 71.33,44.27 63.1,44.27 v62.8,44.58
  Bottom 0.2: v28.57,42.5 30.5,44.42 30.5,53.88 30.93,54.3 32.17,54.3 35.02,51.45 46.95,51.45 50.25,48.15 59.23,48.15 v62.8,44.58
GND  (1 unrouted)
  pour Top (isolate 0.152, rank 2): 89,-0.25 -1,-0.25 -1,57.75 89,57.75
  pour Bottom (isolate 0.152, rank 2): 89,-0.25 -1,-0.25 -1,57.75 89,57.75
GND1
  Top 0.2: IC3.1 64.22,32.03 64.25,32
  pour Top: 59,56.25 59,49.75 58,48.75 54,48.75 52,47.25 52,33.25 53.5,31.75 81.5,31.75 83.5,33.75 83.5,56.25
  pour Bottom: 59,56.25 59,49.75 58,48.75 54,48.75 52,47.25 52,33.25 53.5,31.75 81.5,31.75 83.5,33.75 83.5,56.25
L_BAT  (via drill 0.3)
  Top 0.2: v56.27,12.27 56.73,12.27 60.9,8.1 60.9,4.27 62.18,2.99 U$1.P1_18 | v43.88,26.02 43.65,26.25 42.74,26.25 R28.1
  Bottom 0.2: v56.27,12.27 56.27,13.62 54.7,15.2 52.98,15.2 50.35,17.83 46.45,17.83 43.88,20.4 v43.88,26.02
LCD_CS  (via drill 0.3)
  Top 0.2: v52.8,13.15 52.98,13.15 53.3,12.83 53.3,3.97 U$1.P1_24
  Bottom 0.2: LCD1.4 11.9,43.5 12.62,42.77 12.62,40.35 13.7,39.27 13.7,26.8 24.07,16.42 48.98,16.42 52.25,13.15 v52.8,13.15
LCD_RST
  Bottom 0.2: LCD1.15 11.98,21.5 12.67,22.2 12.67,24.45 13.15,24.93 13.83,24.93 23.52,15.23 48.4,15.23 55.67,7.95 55.67,6.12 55.85,5.95 55.85,4.02 57.1,2.77 U$1.P1_22
LCD_SCK  (via drill 0.3)
  Top 0.2: v53.88,13.45 53.88,12.98 53.73,12.83 53.73,7.08 54.02,6.77 54.62,6.77 | v57.5,9.85 56.52,9.85 56.05,9.38 56.05,8.35 54.62,6.92 54.62,6.77 | 54.62,6.77 54.62,5.31 U$1.P1_23
  Bottom 0.2: LCD1.3 11.4,45.25 13.08,43.58 13.08,40.48 14.12,39.42 14.12,26.95 24.25,16.83 49.17,16.83 52.1,13.9 53.42,13.9 v53.88,13.45 | LCD1.33 85.4,25.43 84.28,24.3 84.28,23.27 83.3,22.3 80.35,22.3 72.65,14.6 67.45,14.6 65.38,12.52 65.38,11.05 64.17,9.85 v57.5,9.85
LCD_SDI  (via drill 0.3)
  Top 0.2: U$1.P1_19 58.27,6.62 56.6,6.62 56.42,6.8 v56.42,6.98 57.27,7.83 v57.27,8.83
  Bottom 0.2: LCD1.6 12.27,39.5 12.85,38.92 12.85,26.5 23.73,15.62 48.6,15.62 56.15,8.08 56.15,7.25 v56.42,6.98 | LCD1.34 85.1,23.5 83.47,21.88 80.5,21.88 72.83,14.2 67.62,14.2 65.78,12.35 65.78,10.85 64.35,9.42 58.08,9.42 57.48,8.83 v57.27,8.83 57.35,8.77
LCD_SDO  (1 unrouted)
  Bottom 0.2: LCD1.5 11.4,40.98 13.27,39.1 13.27,26.65 23.9,16.02 48.77,16.02 57.1,7.7 U$1.P1_21 57.73,5.88 57.73,8.23 58.52,9.02 64.53,9.02 64.67,9.17 65,9.5 66.2,10.7 66.2,12.2 67.8,13.8 73,13.8 80.67,21.48 85.38,21.48
LEFT
  Top 0.3: J3.2 18.3,3.25 17.75,2.7 17,2.7 16.65,2.35 VR1.3
N$1  (via drill 0.3)
  Top 0.2: U$1.P1_7 75.58,5.25 76.72,6.4 78.38,6.4 81.72,9.75 81.72,10.35 v81.85,10.48 81.38,10.95 C28.1 | v84.62,1.38 84.62,2.25 SW3.1
  Bottom 0.2: v81.85,10.48 83.53,10.48 84.62,9.38 v84.62,1.38
N$2
  Top 0.2: C8.2 14.49,39.12 R8.2 16.1,39.85 16.65,40.4 18.6,40.4 20.73,38.27 D2.C 22.85,37.98
  Top 0.6: IC4.EX_PAD 22.85,37.98
N$3
  Top 0.2: IC4.6 17.65,34.44 R18.1 17.65,34.46 17.65,35.33 17,35.98 R19.2
N$4
  Top 0.3: IC4.2 27.54,33.16 27.98,33.6 28.99,33.6 C12.2
N$5
  Top 0.8: F2.P$1 20.65,53.62 21.57,54.55 33.6,54.55 36.93,51.22 JP4.1 36.88,48.7 36.88,46.62 37.65,45.85 41.67,45.85 42.38,46.55 SJ1.1
N$6  (via drill 0.4)
  Top 0.2: C27.1 8.41,45.71 7.83,46.3 J1.2
  Top 0.4: R6.1 32.58,32.77 v32.6,32.75 33.27,32.75 33.62,33.1 33.63,33.09 IC8.4
  Bottom 0.3: 10.92,54.65 6.62,54.65 5.4,53.42 J1.2
  Bottom 0.4: 10.92,54.65 14.55,54.65 16.98,52.23 16.98,42.1 21.95,37.12 26.3,37.12 30.68,32.75 v32.6,32.75
N$7  (via drill 0.3)
  Top 0.2: R14.1 36.35,44.23 36.62,43.95 v36.62,43.35
  Bottom 0.2: D3.A 31.73,52.7 31.73,51.1 33.12,49.7 33.12,45 34.9,43.23 36.5,43.23 v36.62,43.35
N$8
  Top 0.3: C12.1 R15.1
N$9
  Top 0.3: R15.2 29.01,28.31 28.9,28.2
  Top 0.8: D4.C 28.9,28.2 28.48,28.62 L2.2 26.82,28.65 26.82,30.27 27.57,31.02 27.57,31.5 27.18,31.89 IC4.1
N$10
  Top 0.2: IC4.5 18.5,35.7 17.6,36.6 R10.2
N$11
  Top 0.2: R10.1 14.46,37.58 C8.1
N$12
  Top 0.2: JP5.5 74.53,54.25 73.17,52.9 72.7,52.9 72.5,52.7 R24.1
N$13
  Top 0.2: SW1.2 C1.1 49.41,51.4 54.65,51.4 55.2,51.95 55.2,52.88 55.84,53.51 U$1.P6_1
N$14
  Top 0.2: JP5.4 77.5,53.48 77.08,53.05 77.05,53.05 76.97,52.98 74.35,52.98 73.97,52.6 R22.1
N$15
  Top 0.2: R17.2 46.65,53.08 46.48,53.25 D5.K
N$16
  Top 0.8: F2.P$2 11.48,53.62 10.58,54.52 6.6,54.52 5.45,53.38 5.45,50.15 1.48,46.17 1.48,39.23 4.2,36.5 6.68,36.5 JP1.1
N$17
  Top 0.3: R11.1 44.41,35.04 44.92,35.55 IC6.7
  Top 0.4: R11.1 R12.2
N$18
  cutout Bottom: 53,30.25 58.5,30.25 59,29.75 59,16.25 58.5,15.75 53,15.75 52.5,16.25 52.5,29.75
  cutout Top: 53,30.25 58.5,30.25 59,29.75 59,16.25 58.5,15.75 53,15.75 52.5,16.25 52.5,29.75
N$19  (via drill 0.3)
  Top 0.2: IC4.8 15.87,31.89 v15.52,31.55 | v19.02,37.25 19.02,37.92 18.6,38.35 18.6,38.9 18.38,39.12 R8.1
  Bottom 0.2: v15.52,31.55 15.02,31.55 14.55,32.02 14.55,35 15.4,35.85 17.62,35.85 v19.02,37.25
N$21
  Top 0.3: IC4.4 R13.1
N$22
  Top 0.2: IC1.10 71.75,36.1 72.3,35.55 C2.1
N$23
  Top 0.2: 21.55,52.24 R1.2 | Q2.G 25.35,52.5 24.6,53.25 21.8,53.25 21.44,52.89 R1.2 | Q3.3 21.55,52.16 R1.2
N$24
  Top 0.2: IC4.7 17.75,33.16 C11.1
N$26  (via drill 0.3)
  Top 0.2: v27.25,45.25 27.25,45.8 27.52,46.08
  Top 0.3: Q2.D 25.3,48.4 26,47.7 C14.+ 27.3,46.3 27.52,46.08 27.62,45.98 IC5.4
  Bottom 0.2: D3.K 29.23,47.23 v27.25,45.25
N$27
  Top 0.2: IC5.1 32.55,44.08 32.67,44.2 33.21,44.2 R14.2 R7.2
N$28
  Top 0.4: C10.1 41.14,39.36 C7.1 41.08,38 40.5,37.42 IC8.8 | IC6.6 45.58,37.42 45.12,37.88 44.45,37.88 44.12,38.2 L1.2 | R11.2 42.34,36.56 41.99,36.91 IC8.8 | IC6.9 44.27,29.77 43.98,29.48 40.1,29.48 38.45,31.12 38.45,32.8 38.75,33.1 IC8.5 IC8.6 IC8.7 IC8.8
  Top 0.8: C7.1 42.08,39.3 42.67,39.9 44.08,39.9 L1.2
N$29  (via drill 0.3)
  Top 0.2: R17.1 46.65,49.35 v46.88,49.12 | IC6.10 44.92,27.55 44.5,27.12 v43.88,27.12 43.29,27.71 R28.2 42.65,27.74 R16.1
  Bottom 0.2: v46.88,49.12 46.88,47.2 43.88,44.2 v43.88,27.12
N$30
  Top 0.4: IC6.2 48.17,39.9 L1.1 48.7,39.38 48.7,38.3 48.83,38.17 IC6.1
N$35
  Top 0.3: IC5.5 27.11,44.08 R9.2
N$36
  Top 0.3: C17.+ 30.33,18.08 29.85,17.6 29.85,16.15 30.18,15.83 IC7.8
N$37
  Top 0.3: IC7.5 29.97,12.02 29.73,11.77 29.73,10.17 30.02,9.88 C18.+
N$39
  Top 0.2: IC7.6 29.79,13.29 29.12,12.62 29.12,8.88 26.5,6.25 VR2.2
N$41
  Top 0.2: IC7.7 29.46,14.56 28.6,13.7 28.6,10.7 27.65,9.75 25.02,9.75 23.75,11.02 21.15,11.02 15.52,5.4 15.52,4.23 VR1.2
N$42
  Top 0.3: IC7.1 24.95,15.83 24.57,16.2 24.57,18.55 24.38,18.75 C22.+
N$43
  Top 0.3: IC7.3 24.98,13.29 24.27,14 22.73,14 C23.+
N$44
  Top 0.3: JP2.1 4.77,6.34 5.2,6.77 5.77,6.77 6.04,7.04 C24.2 6.02,7.71 6.02,8.48 6.45,8.9 12,8.9 13.52,10.42 13.52,18.33 13.95,18.75 C22.-
N$45
  Top 0.3: JP3.1 11.27,5.77 12.27,6.77 12.27,7.69 | 12.27,7.69 C25.2 | 12.27,7.69 12.27,8.12 14.12,9.98 14.15,9.98 14.17,10 14.17,11.75 14.62,12.2 14.62,13.1 C23.-
N$46
  Top 0.2: R20.1 C24.1
N$47
  Top 0.2: R21.1 C25.1
NONE
  cutout Bottom: 61.5,33.25 61.5,39.75 62.5,40.75 69.5,40.75 70,40.25 70,32.75 69.5,32.25 62.5,32.25
  cutout Top: 61.5,33.25 61.5,39.75 62.5,40.75 69.5,40.75 70,40.25 70,32.75 69.5,32.25 62.5,32.25
RELAY1  (3 unrouted)
RELAY2  (3 unrouted)
RIGHT
  Top 0.3: J3.3 23.1,4.95 25.3,2.75 27.25,2.75 27.65,2.35 VR2.3
RXI
  Top 0.2: U1.1 59.73,13.92 61.5,12.15 62.73,12.15 68.53,6.35 68.53,4.67 69.22,3.98 71.08,3.98 U$1.P1_10
SCK
  Top 0.2: U$1.P1_13 67.26,5.41 66.17,6.5 63.42,6.5 63.1,6.83 63.1,8.65 56.1,15.65 52,15.65 51.48,16.17 51.48,30.77 52.2,31.5 56.05,31.5 57.77,33.23 58.5,33.23 | IC3.2 65.49,34.76 65.25,35 62.27,35 61.7,34.42 61.7,34.08 60.85,33.23 58.5,33.23 | R27.1 58.59,33.14 58.5,33.23
SCL1  (via drill 0.3)
  Top 0.2: U$1.P1_5 77.85,5.25 82.65,10.05 82.65,38.5 81.85,39.3 R3.1 80.67,39.14 80.67,38.42 80.33,38.08 v80.28,38.08 | IC2.8 78,35.45 77.78,35.23 77.1,35.23 76.45,34.58 75.1,34.58 74.35,35.33 IC1.14 74.35,38.52 v74.33,38.55
  Bottom 0.2: v80.28,38.08 79.78,38.08 79.67,38.17 79.67,41.23 79.38,41.52 76.65,41.52 76.15,41.02 76.15,38.98 75.5,38.33 74.55,38.33 v74.33,38.55
SDA1  (via drill 0.3)
  Top 0.2: U$1.P1_3 79.96,6.76 83.08,9.88 83.08,39.42 81.85,40.65 80.74,40.65 R2.1 80.74,41.69 v80.75,41.95 | IC2.7 79.25,37.05 79.08,37.23 77.6,37.23 76.6,36.23 76.6,35.33 76.25,34.98 75.4,34.98 75,35.38 IC1.15 75,38.8 v75.25,39.05
  Bottom 0.2: v75.25,39.05 75.25,40.73 76.47,41.95 v80.75,41.95
TEMP-V  (via drill 0.3)
  Top 0.3: IC1.6 72.4,44.98 v72.38,45
  Bottom 0.3: IC9.2 63,46.98 64.4,45.58 71.8,45.58 v72.38,45
TP_CS  (via drill 0.3)
  Top 0.2: 55.92,10.3 v55.92,10.33 55.58,9.98 55.58,8.55 54.7,7.67 v54.42,7.67
  Bottom 0.2: LCD1.32 85.4,27.1 83.85,25.55 83.85,23.45 83.1,22.7 80.17,22.7 72.47,15 67.28,15 64.97,12.7 64.97,11.23 64.03,10.27 58.38,10.27 58.12,10.52 56.15,10.52 55.95,10.33 v55.92,10.33 | U$1.P1_26 53.33,4.02 53.33,5.65 54.42,6.75 v54.42,7.67
TP_IRQ
  Bottom 0.2: U$1.P1_11 67.62,7.42 67.62,11.88 68,12.25 73.5,12.25 80.75,19.5 LCD1.36
TXO
  Top 0.2: U1.2 61.23,14.9 60.52,14.2 60.52,13.73 61.67,12.58 62.9,12.58 68.95,6.52 73.2,6.52 73.62,6.1 73.62,3.97 U$1.P1_8

### Text on the board
_tplace: TEMP SENSOR | GND | CH3 | CH2 | CH1 | CH0 | RESET | POWER S/W | DC6V~30V IN | 1CELL LIFO BAT | - | + | FAN | LEFT | RIGHT | GND | +5V | SW | - | + | - | + | AUDIO IN
_bplace: V1.0 | STAND ALONE PI SHIELD